# EAGLE design GPIB_2012 (EAGLE 5.11)

## Sheet 1 of 3
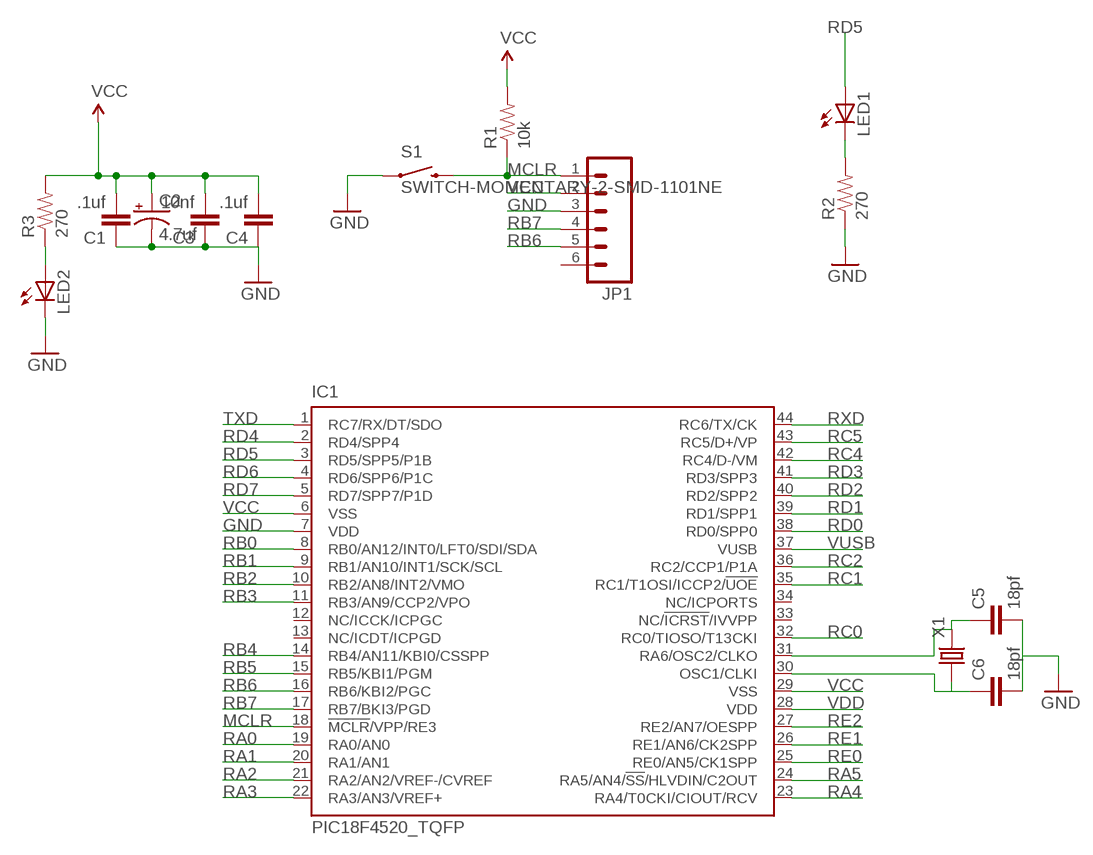
[diagram p0: schematic, sheet 1]

### Parts
C1  .1uf  CAP0805  [0805]
C2  4.7uf  CAP_POL6032  [EIA6032]
C3  10nf  CAP0805  [0805]
C4  .1uf  CAP0805  [0805]
C5  18pf  CAP0805  [0805]
C6  18pf  CAP0805  [0805]
IC1  PIC18F4520_TQFP  PIC18F4550_TQFP  [TQFP44]
JP1  M06SIP  [1X06]
LED1  LEDCHIPLED_1206  [CHIPLED_1206]
LED2  LEDCHIPLED_1206  [CHIPLED_1206]
R1  10k  RESISTOR0805-RES  [0805]
R2  270  RESISTOR0805-RES  [0805]
R3  270  RESISTOR0805-RES  [0805]
S1  SWITCH-MOMENTARY-2-SMD-1101NE  [TACTILE-SWITCH-1101NE]
X1  CRYSTAL-5032  [5032]

### Nets
GND: C1.1 C2.P$2(-) C3.1 C4.1 C5.2 C6.2 IC1.7(VDD) JP1.3 LED2.C R2.1 S1.P$1 ; also sheet 2,3
MCLR: IC1.18(!MCLR!/VPP/RE3) JP1.1 R1.1 S1.P$2
N$4: C5.1 IC1.31(RA6/OSC2/CLKO) X1.2
N$5: C6.1 IC1.30(OSC1/CLKI) X1.1
N$6: LED1.C R2.2
N$7: LED2.A R3.1
RA0: IC1.19(RA0/AN0) ; also sheet 3
RA1: IC1.20(RA1/AN1) ; also sheet 3
RA2: IC1.21(RA2/AN2/VREF-/CVREF) ; also sheet 3
RA3: IC1.22(RA3/AN3/VREF+) ; also sheet 3
RA4: IC1.23(RA4/T0CKI/CIOUT/RCV) ; also sheet 3
RA5: IC1.24(RA5/AN4/!SS!/HLVDIN/C2OUT) ; also sheet 3
RB0: IC1.8(RB0/AN12/INT0/LFT0/SDI/SDA) ; also sheet 3
RB1: IC1.9(RB1/AN10/INT1/SCK/SCL) ; also sheet 3
RB2: IC1.10(RB2/AN8/INT2/VMO) ; also sheet 3
RB3: IC1.11(RB3/AN9/CCP2/VPO) ; also sheet 3
RB4: IC1.14(RB4/AN11/KBI0/CSSPP) ; also sheet 3
RB5: IC1.15(RB5/KBI1/PGM) ; also sheet 3
RB6: IC1.16(RB6/KBI2/PGC) JP1.5 ; also sheet 3
RB7: IC1.17(RB7/BKI3/PGD) JP1.4 ; also sheet 3
RC0: IC1.32(RC0/TIOSO/T13CKI)
RC1: IC1.35(RC1/T1OSI/ICCP2/!UOE)
RC2: IC1.36(RC2/CCP1/P1A)
RC4: IC1.42(RC4/D-/VM)
RC5: IC1.43(RC5/D+/VP)
RD0: IC1.38(RD0/SPP0)
RD1: IC1.39(RD1/SPP1)
RD2: IC1.40(RD2/SPP2)
RD3: IC1.41(RD3/SPP3)
RD4: IC1.2(RD4/SPP4)
RD5: IC1.3(RD5/SPP5/P1B) LED1.A
RD6: IC1.4(RD6/SPP6/P1C)
RD7: IC1.5(RD7/SPP7/P1D)
RE0: IC1.25(RE0/AN5/CK1SPP) ; also sheet 3
RE1: IC1.26(RE1/AN6/CK2SPP) ; also sheet 3
RE2: IC1.27(RE2/AN7/OESPP)
RXD: IC1.44(RC6/TX/CK) ; also sheet 2
TXD: IC1.1(RC7/RX/DT/SDO) ; also sheet 2
VCC: C1.2 C2.P$1(+) C3.2 C4.2 IC1.6(VSS) IC1.29(VSS) JP1.2 R1.2 R3.2 ; also sheet 2,3
VDD: IC1.28(VDD)
VUSB: IC1.37(VUSB)
Unconnected: IC1.12(NC/ICCK/ICPGC) IC1.13(NC/ICDT/ICPGD) IC1.33(NC/!ICRST!/IVVPP) IC1.34(NC/ICPORTS) JP1.6

## Sheet 2 of 3
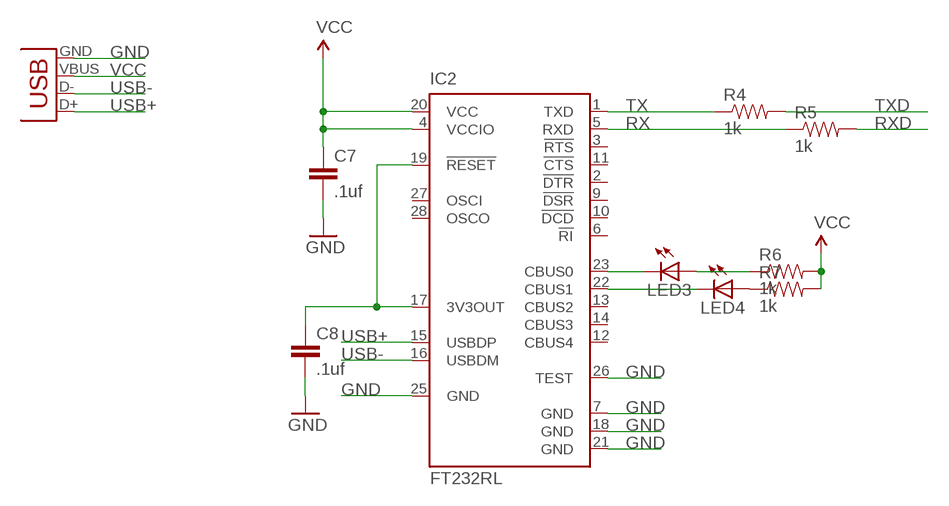
[diagram p1: schematic, sheet 2]

### Parts
C7  .1uf  CAP0805  [0805]
C8  .1uf  CAP0805  [0805]
IC2  FT232RL  [SSOP28]
LED3  LEDCHIPLED_1206  [CHIPLED_1206]
LED4  LEDCHIPLED_1206  [CHIPLED_1206]
R4  1k  RESISTOR0805-RES  [0805]
R5  1k  RESISTOR0805-RES  [0805]
R6  1k  RESISTOR0805-RES  [0805]
R7  1k  RESISTOR0805-RES  [0805]
X2  USBPTH  [USB-B-PTH]

### Nets
GND: C7.2 C8.2 IC2.7(GND) IC2.18(GND) IC2.21(GND) IC2.25(GND) IC2.26(TEST) X2.GND ; also sheet 1,3
LED_RX: IC2.23(CBUS0) LED3.C
LED_TX: IC2.22(CBUS1) LED4.C
N$1: LED3.A R6.1
N$2: LED4.A R7.1
N$3: C8.1 IC2.17(3V3OUT) IC2.19(!RESET)
RX: IC2.5(RXD) R5.1
RXD: R5.2 ; also sheet 1
TX: IC2.1(TXD) R4.1
TXD: R4.2 ; also sheet 1
USB+: IC2.15(USBDP) X2.D+
USB-: IC2.16(USBDM) X2.D-
VCC: C7.1 IC2.4(VCCIO) IC2.20(VCC) R6.2 R7.2 X2.VBUS ; also sheet 1,3
Unconnected: IC2.2(!DTR) IC2.3(!RTS) IC2.6(!RI) IC2.9(!DSR) IC2.10(!DCD) IC2.11(!CTS) IC2.12(CBUS4) IC2.13(CBUS2) IC2.14(CBUS3) IC2.27(OSCI) IC2.28(OSCO)

## Sheet 3 of 3
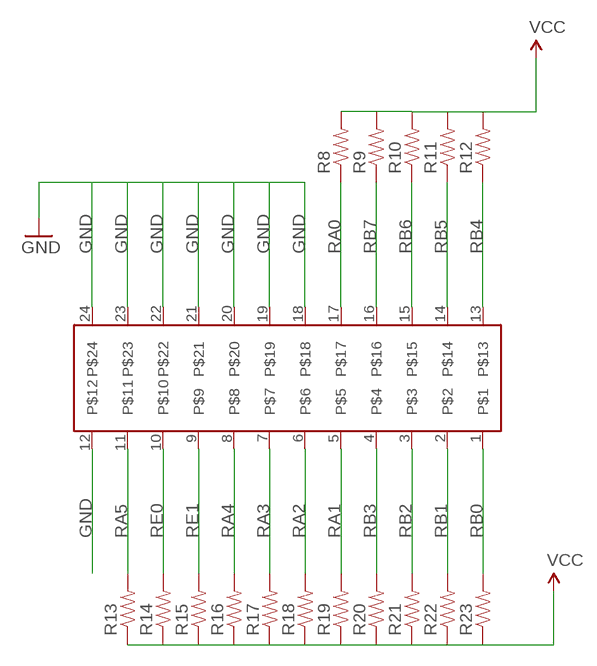
[diagram p2: schematic, sheet 3]

### Parts
R8  RESISTOR0805-RES  [0805]
R9  RESISTOR0805-RES  [0805]
R10  RESISTOR0805-RES  [0805]
R11  RESISTOR0805-RES  [0805]
R12  RESISTOR0805-RES  [0805]
R13  RESISTOR0805-RES  [0805]
R14  RESISTOR0805-RES  [0805]
R15  RESISTOR0805-RES  [0805]
R16  RESISTOR0805-RES  [0805]
R17  RESISTOR0805-RES  [0805]
R18  RESISTOR0805-RES  [0805]
R19  RESISTOR0805-RES  [0805]
R20  RESISTOR0805-RES  [0805]
R21  RESISTOR0805-RES  [0805]
R22  RESISTOR0805-RES  [0805]
R23  RESISTOR0805-RES  [0805]
U$1  112-024-213R001  24CONN24  [24CONN]

### Nets
GND: U$1.12 U$1.18 U$1.19 U$1.20 U$1.21 U$1.22 U$1.23 U$1.24 ; also sheet 1,2
RA0: R8.1 U$1.17 ; also sheet 1
RA1: R19.2 U$1.5 ; also sheet 1
RA2: R18.2 U$1.6 ; also sheet 1
RA3: R17.2 U$1.7 ; also sheet 1
RA4: R16.2 U$1.8 ; also sheet 1
RA5: R13.2 U$1.11 ; also sheet 1
RB0: R23.2 U$1.1 ; also sheet 1
RB1: R22.2 U$1.2 ; also sheet 1
RB2: R21.2 U$1.3 ; also sheet 1
RB3: R20.2 U$1.4 ; also sheet 1
RB4: R12.1 U$1.13 ; also sheet 1
RB5: R11.1 U$1.14 ; also sheet 1
RB6: R10.1 U$1.15 ; also sheet 1
RB7: R9.1 U$1.16 ; also sheet 1
RE0: R14.2 U$1.10 ; also sheet 1
RE1: R15.2 U$1.9 ; also sheet 1
VCC: R8.2 R9.2 R10.2 R11.2 R12.2 R13.1 R14.1 R15.1 R16.1 R17.1 R18.1 R19.1 R20.1 R21.1 R22.1 R23.1 ; also sheet 1,2

## Library data of the parts
C1 C3-C8 = SparkFun:CAP: Capacitor Standard 0603 ceramic capacitor, and 0.1" leaded capacitor.
C2 = SparkFun:CAP_POL: Capacitor Polarized These are standard SMD and PTH capacitors. Normally 10uF, 47uF, and 100uF in electrolytic and tantalum varieties. Always verify the external diameter of the through hole cap, it varies with capacity, voltage, and manufacturer. The EIA devices should be standard.
IC1 = microchip:PIC18F4*_TQFP: USB Microcontrollers with nanoWatt Technology High-Performance, Enhanced Flash, 28/40/44-Pin, Source: http://ww1.microchip.com/downloads/en/devicedoc/39632c.pdf; MF: MICROCHIP; MPN: PIC18F4550-I/PT; OC_FARNELL: 9321365; OC_NEWARK: 08J9633
IC2 = ftdichip:FT232R: Source: http://www.ftdichip.com/Documents/DataSheets/DS_FT232R_v104.pdf; MPN: FT232RL; OC_FARNELL: 1146032; OC_NEWARK: 91K9918
JP1 = SparkFun:M06: Header 6 Standard 6-pin 0.1" header. Use with straight break away headers (SKU : PRT-00116), right angle break away headers (PRT-00553), swiss pins (PRT-00743), machine pins (PRT-00117), and female headers (PRT-00115). Molex polarized connector foot print use with SKU : PRT-08094 with associated crimp pins and housings. NOTES ON THE VARIANTS LOCK and LOCK_LONGPADS... This footprint was designed to help hold the alignment of a through-hole component (i.e. 6-pin header) while soldering it into place. You may notice that each hole has been shifted either up or down by 0.005 of an inch from it's more standard position (which is a perfectly straight line). This slight alteration caused the pins (the squares in the middle) to touch the edges of the holes. Because they are alternating, it causes a "brace" to hold the component in place. 0.005 has proven to be the perfect amount of "off-center" position when using our standard breakaway headers. Although looks a little odd when you look at the bare footprint, once you have a header in there, the alteration is very hard to notice. Also, if you push a header all the way into place, it is covered up entirely on the bottom side. This idea of altering the position of holes to aid alignment will be further integrated into the Sparkfun Library for other footprints. It can help hold any component with 3 or more connection pins.
LED1-LED4 = led:LED: LED OSRAM: - CHIPLED LG R971, LG N971, LY N971, LG Q971, LY Q971, LO R971, LY R971 LH N974, LH R974 LS Q976, LO Q976, LY Q976 LO Q996 - Hyper CHIPLED LW Q18S LB Q993, LB Q99A, LB R99A - SideLED LS A670, LO A670, LY A670, LG A670, LP A670 LB A673, LV A673, LT A673, LW A673 LH A674 LY A675 LS A676, LA A676, LO A676, LY A676, LW A676 LS A679, LY A679, LG A679 - Hyper Micro SIDELED® LS Y876, LA Y876, LO Y876, LY Y876 LT Y87S - SmartLED LW L88C, LW L88S LB L89C, LB L89S, LG L890 LS L89K, LO L89K, LY L89K LS L896, LA L896, LO L896, LY L896 - TOPLED LS T670, LO T670, LY T670, LG T670, LP T670 LSG T670, LSP T670, LSY T670, LOP T670, LYG T670 LG T671, LOG T671, LSG T671 LB T673, LV T673, LT T673, LW T673 LH T674 LS T676, LA T676, LO T676, LY T676, LB T676, LH T676, LSB T676, LW T676 LB T67C, LV T67C, LT T67C, LS T67K, LO T67K, LY T67K, LW E67C LS E67B, LA E67B, LO E67B, LY E67B, LB E67C, LV E67C, LT E67C LW T67C LS T679, LY T679, LG T679 LS T770, LO T770, LY T770, LG T770, LP T770 LB T773, LV T773, LT T773, LW T773 LH T774 LS E675, LA E675, LY E675, LS T675 LS T776, LA T776, LO T776, LY T776, LB T776 LHGB T686 LT T68C, LB T68C - Hyper Mini TOPLED® LB M676 - Mini TOPLED Santana® LG M470 LS M47K, LO M47K, LY M47K Source: http://www.osram.convergy.de LUXEON: - LUMILED® LXK2-PW12-R00, LXK2-PW12-S00, LXK2-PW14-U00, LXK2-PW14-V00 LXK2-PM12-R00, LXK2-PM12-S00, LXK2-PM14-U00 LXK2-PE12-Q00, LXK2-PE12-R00, LXK2-PE12-S00, LXK2-PE14-T00, LXK2-PE14-U00 LXK2-PB12-K00, LXK2-PB12-L00, LXK2-PB12-M00, LXK2-PB14-N00, LXK2-PB14-P00, LXK2-PB14-Q00 LXK2-PR12-L00, LXK2-PR12-M00, LXK2-PR14-Q00, LXK2-PR14-R00 LXK2-PD12-Q00, LXK2-PD12-R00, LXK2-PD12-S00 LXK2-PH12-R00, LXK2-PH12-S00 LXK2-PL12-P00, LXK2-PL12-Q00, LXK2-PL12-R00 Source: www.luxeon.com KINGBRIGHT: KA-3528ASYC Source: www.kingbright.com
R1-R23 = SparkFun:RESISTOR: Resistor Basic schematic elements and footprints for 0603, 1206, and PTH resistors.
S1 = SparkFun:SWITCH-MOMENTARY-2
U$1 = GPIB_2012:24CONN
X1 = slice_noshift:CRYSTAL*: CRYSTAL
X2 = SparkFun:USB: USB Connectors USB-B-PTH is fully proven SKU : PRT-00139 USB-miniB is fully proven SKU : PRT-00587 USB-A-PCB is untested. USB-A-H is throughly reviewed, but untested. Spark Fun Electronics SKU : PRT-00437 USB-B-SMT is throughly reviewed, but untested. Needs silkscreen touching up. USB-A-S has not been used/tested USB-MB-H has not been used/tested

## Board
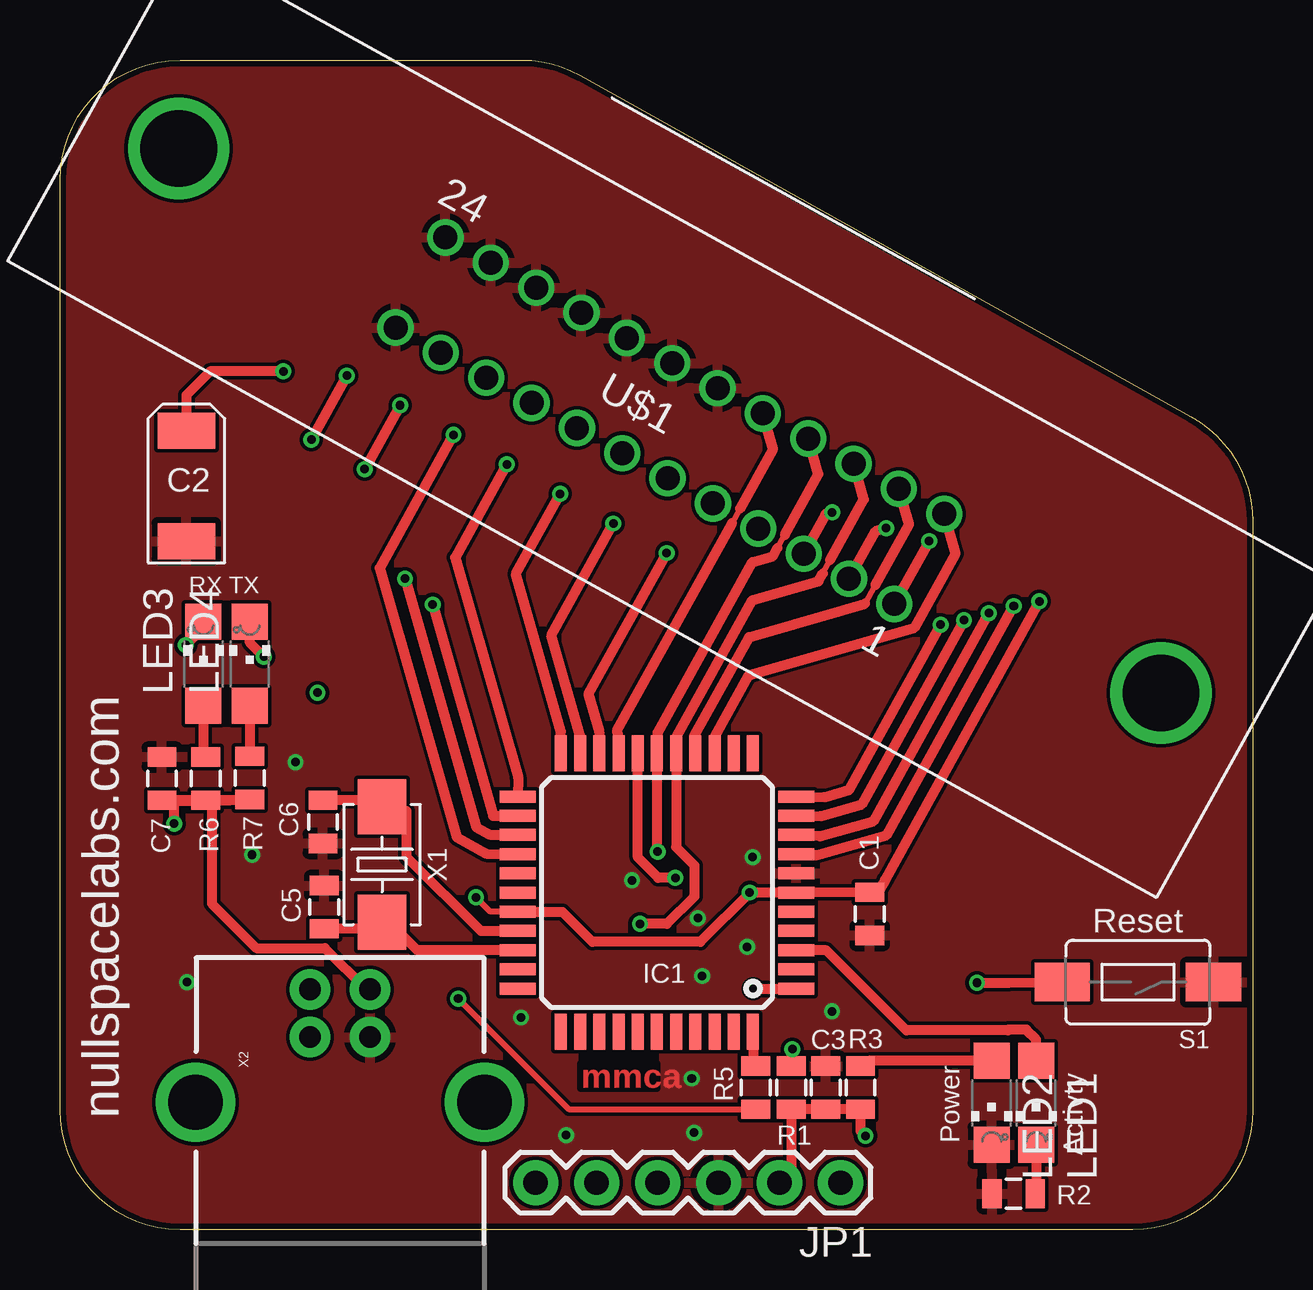
[diagram p3: board, top side]
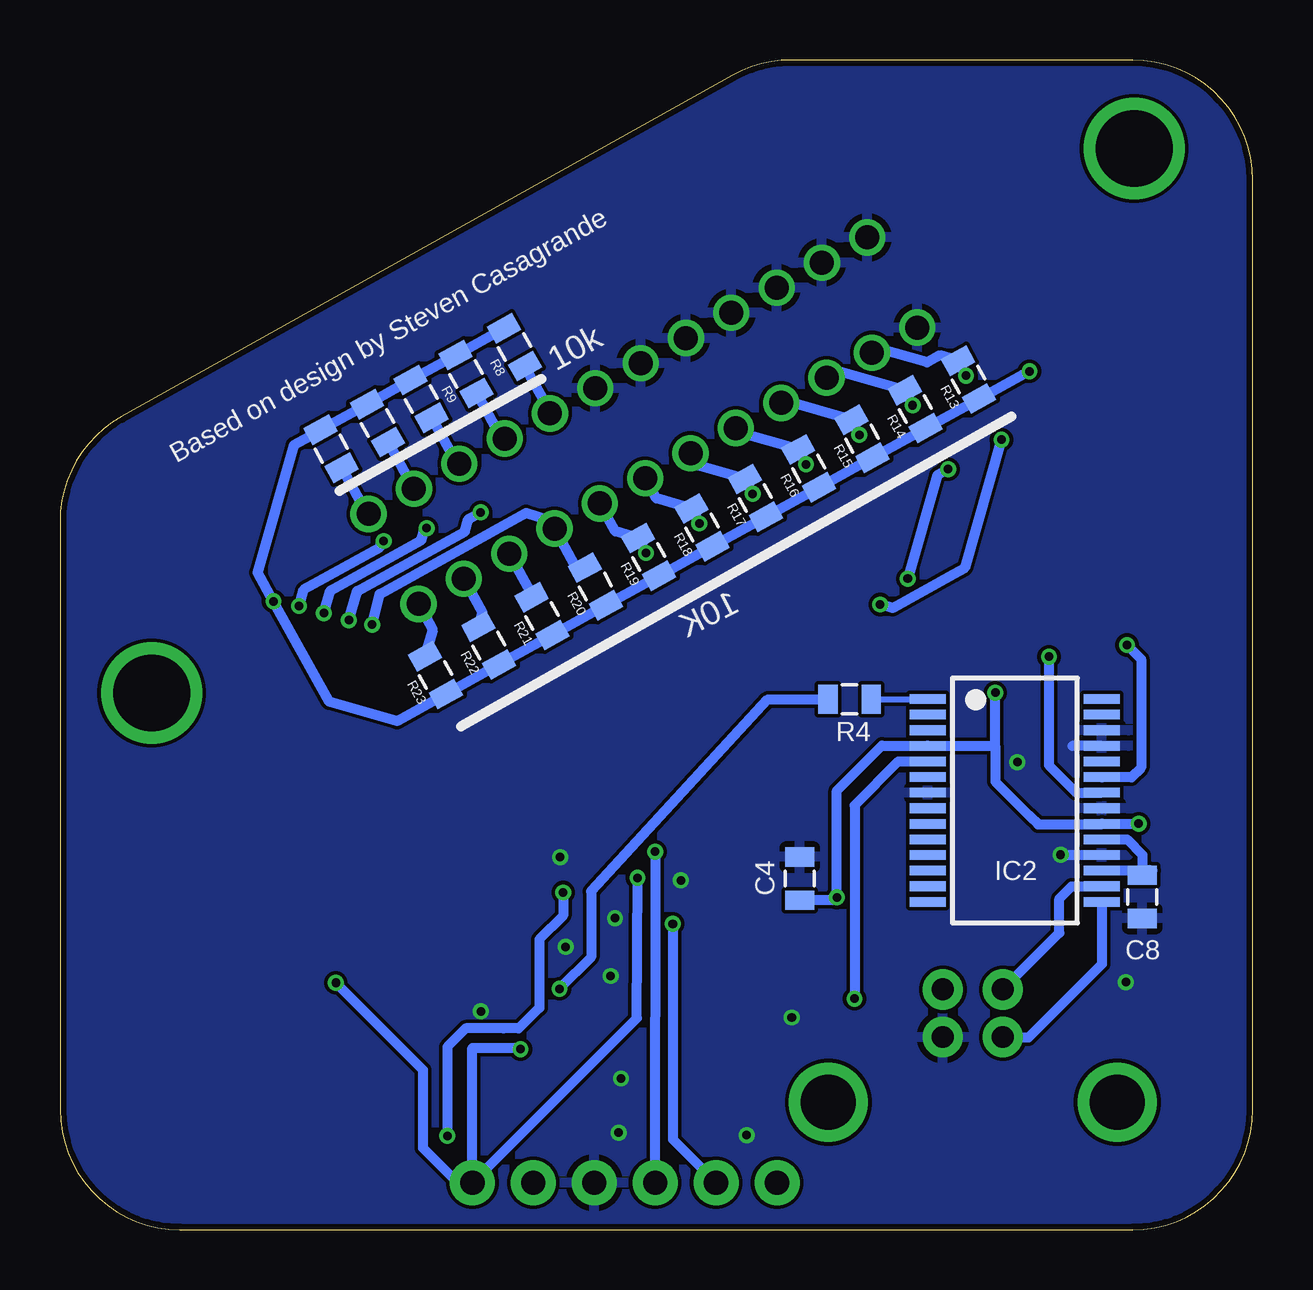
[diagram p4: board, bottom side, seen from below]

Size 49.7 x 48.74 mm. Coordinates in mm from the lower left corner, seen from the top.
Outline: 0,43.74 arc-90 5,48.74 19.23,48.74 arc-29 21.67,48.1 47.14,33.87 arc-61 49.7,29.5 49.7,5 arc-90 44.7,0 5,0 arc-90 0,5 0,43.74
Copper layers (1*16): Top 0.035mm / dielectric 1.5mm / Bottom 0.035mm
Design rules "ITead_rule": minimum track width 6mil, minimum drill 12mil, track to track 6mil, track to pad 6mil, pad to pad 6mil, via to via 6mil, smd to smd 0mil, copper to edge 10mil, drill to drill 10mil, minimum pad ring 10mil, minimum via ring 6mil, stop-mask expansion 2mil, vias tented up to drill 100mil, thermal gap 10mil

### Footprints (pad centres in the part's own frame; a part is rotated, then mirrored left to right if it is on the bottom)
0805 = smd 0.8 x 1.2: 1 -0.9,0; 2 0.9,0
EIA6032 = smd 1.5 x 2.4: P$1 -2.3,0; P$2 2.3,0
TQFP44 = smd 1.5 x 0.5: 1 -5.8,4; 2 -5.8,3.2; 3 -5.8,2.4; 4 -5.8,1.6; 5 -5.8,0.8; 6 -5.8,0; 7 -5.8,-0.8; 8 -5.8,-1.6; 9 -5.8,-2.4; 10 -5.8,-3.2; 11 -5.8,-4; 23 5.8,-4; 24 5.8,-3.2; 25 5.8,-2.4; 26 5.8,-1.6; 27 5.8,-0.8; 28 5.8,0; 29 5.8,0.8; 30 5.8,1.6; 31 5.8,2.4; 32 5.8,3.2; 33 5.8,4 | smd 0.5 x 1.5: 12 -4,-5.8; 13 -3.2,-5.8; 14 -2.4,-5.8; 15 -1.6,-5.8; 16 -0.8,-5.8; 17 0,-5.8; 18 0.8,-5.8; 19 1.6,-5.8; 20 2.4,-5.8; 21 3.2,-5.8; 22 4,-5.8; 34 4,5.8; 35 3.2,5.8; 36 2.4,5.8; 37 1.6,5.8; 38 0.8,5.8; 39 0,5.8; 40 -0.8,5.8; 41 -1.6,5.8; 42 -2.4,5.8; 43 -3.2,5.8; 44 -4,5.8
SSOP28 = smd 0.4 x 1.5: 1 -4.225,-3.625; 2 -3.575,-3.625; 3 -2.925,-3.625; 4 -2.275,-3.625; 5 -1.625,-3.625; 6 -0.975,-3.625; 7 -0.325,-3.625; 8 0.325,-3.625; 9 0.975,-3.625; 10 1.625,-3.625; 11 2.275,-3.625; 12 2.925,-3.625; 13 3.575,-3.625; 14 4.225,-3.625; 15 4.225,3.625; 16 3.575,3.625; 17 2.925,3.625; 18 2.275,3.625; 19 1.625,3.625; 20 0.975,3.625; 21 0.325,3.625; 22 -0.325,3.625; 23 -0.975,3.625; 24 -1.625,3.625; 25 -2.275,3.625; 26 -2.925,3.625; 27 -3.575,3.625; 28 -4.225,3.625
1X06 = drill 1.016 pad 1.88 round: 1 0,0; 2 2.54,0; 3 5.08,0; 4 7.62,0; 5 10.16,0; 6 12.7,0
CHIPLED_1206 = smd 1.5 x 1.5: A 0,-1.75; C 0,1.75
TACTILE-SWITCH-1101NE = smd 2.3 x 1.6: P$1 -3.15,0; P$2 3.15,0
24CONN = drill 1 round: 1 11.88,-2.145; 2 9.72,-2.145; 3 7.56,-2.145; 4 5.4,-2.145; 5 3.24,-2.145; 6 1.08,-2.145; 7 -1.08,-2.145; 8 -3.24,-2.145; 9 -5.4,-2.145; 10 -7.56,-2.145; 11 -9.72,-2.145; 12 -11.88,-2.145; 13 11.88,2.145; 14 9.72,2.145; 15 7.56,2.145; 16 5.4,2.145; 17 3.24,2.145; 18 1.08,2.145; 19 -1.08,2.145; 20 -3.24,2.145; 21 -5.4,2.145; 22 -7.56,2.145; 23 -9.72,2.145; 24 -11.88,2.145 | drill 3.2 round: P$1 23.4,0; P$2 -23.4,0
5032 = smd 2.286 x 2.032: 1 -2.413,0; 2 2.413,0
USB-B-PTH = drill 0.914 pad 1.676 round: D+ 0,1.25; D- 1.981,1.25; GND 0,-1.25; VBUS 1.981,-1.25 | drill 2.286 round: S1 -2.718,-6.02; S2 -2.718,6.02

### Placement (x,y rotation side)
C1  33.74,13.16 90 top
C2  5.27,30.99 270 top
C3  31.91,5.92 270 top
C4  18.88,14.63 270 bottom
C5  11.01,13.44 90 top
C6  10.96,16.99 270 top
C7  4.25,18.8 90 top
C8  4.61,13.87 270 bottom
IC1  24.87,14.05 180 top
IC2  9.91,17.88 270 bottom
JP1  32.52,1.96 180 top
LED1  40.67,5.28 180 top
LED2  38.82,5.28 180 top
LED3  5.98,23.57 0 top
LED4  7.91,23.57 0 top
R1  30.46,5.92 270 top
R2  39.73,1.5 0 top
R3  33.36,5.92 270 top
R4  16.8,22.1 180 bottom
R5  28.99,5.92 90 top
R6  6.08,18.8 270 top
R7  7.91,18.82 270 top
R8  30.76,36.77 119 bottom
R9  32.78,35.65 119 bottom
R10  34.65,34.62 119 bottom
R11  36.47,33.61 119 bottom
R12  38.4,32.54 119 bottom
R13  11.84,35.42 119 bottom
R14  14.07,34.19 119 bottom
R15  16.29,32.95 119 bottom
R16  18.51,31.72 119 bottom
R17  20.73,30.49 119 bottom
R18  22.95,29.26 119 bottom
R19  25.17,28.03 119 bottom
R20  27.39,26.8 119 bottom
R21  29.61,25.57 119 bottom
R22  31.84,24.34 119 bottom
R23  34.06,23.1 119 bottom
S1  44.91,10.31 180 top
U$1  25.41,33.7 331 top
X1  13.42,15.21 270 top
X2  11.67,8.03 90 top

### Tracks (layer width: path | path; a pad name or v marks a point on that pad's centre or on a via)
GND  (via drill 0.36)
  Top 0.406: JP1.3 27.44,2.24 | IC1.7 30.71,14.88
  Bottom 0.406: IC2.18 8.02,15.61 arc-89 8.03,15.6 | IC2.25 7.52,20.16
  other vias: 8.01,15.62 5.29,10.31 9.81,19.48 26.58,12.98 26.75,10.57 28.63,11.79 32.16,9.09 28.86,15.52 26.32,6.3 26.42,4.04 21.09,3.94 19.21,8.84 23.83,14.55
  pour Bottom: -1.36,49.2 -1.36,-0.58 50.58,-0.58 50.58,32.92 50.4,33.1 20.71,49.89 -0.65,49.89 arc90 -1.34,49.2
  pour Top: -1.34,49.4 -1.34,-0.94 50.78,-0.94 50.78,33.86 50.73,33.86 20.94,49.71 -1.03,49.71 arc90
LED_RX  (via drill 0.36)
  Top 0.406: v5.24,24.36 5.98,25.1 LED3.C
  Bottom 0.406: IC2.23 5.06,18.85 4.66,19.25 4.66,23.77 v5.24,24.36
LED_TX  (via drill 0.36)
  Top 0.406: v8.49,23.88 7.91,24.46 LED4.C
  Bottom 0.406: IC2.22 7.35,18.21 8.49,19.36 v8.49,23.88
MCLR  (via drill 0.36)
  Top 0.406: IC1.18 24.07,15.51 24.93,14.66 v25.64,14.66 25.61,14.66 | v30.51,7.52 30.46,7.47 R1.1 | S1.P$2 39.53,10.29 v38.21,10.29
  Bottom 0.406: v25.64,14.66 25.66,8.81 JP1.1 | JP1.1 32.52,7.52 32.52,7.57 30.56,7.57 v30.51,7.52 | v38.21,10.29 34.58,6.66 34.58,3.4 33.13,1.96 JP1.1
N$1
  Top 0.406: R6.1 5.98,19.8 LED3.A
N$2
  Top 0.406: LED4.A R7.1
N$3
  Bottom 0.406: IC2.17 4.19,14.96 arc-90 C8.1 4.61,15.62 5.24,16.26 IC2.19
N$4
  Top 0.406: C5.1 13.15,12.54 arc90 X1.2 arc-90 13.97,12.56 14.88,11.65 IC1.31
N$5
  Top 0.406: C6.1 13.99,17.89 arc-90 X1.1 14.43,17.45 14.44,15.55 17.53,12.45 IC1.30
N$6
  Top 0.406: R2.2 40.67,1.54 LED1.C
N$7
  Top 0.406: R3.1 33.42,6.76 33.7,7.03 LED2.A
RA0
  Top 0.254: 28.01,29.44 28.34,30.04
  Top 0.406: IC1.19 23.25,20.61 23.2,20.78 28.01,29.44 | 28.34,30.04 29.71,32.52 U$1.17
  Bottom 0.406: R8.1 29.27,34.08 U$1.17
RA1  (via drill 0.36)
  Top 0.406: IC1.20 22.46,20.75 22.02,22.31 v25.28,28.19
  Bottom 0.406: U$1.5 26.56,29.09 R19.2 25.27,28.22 v25.28,28.19
RA2  (via drill 0.36)
  Top 0.406: IC1.21 21.66,20.62 20.47,24.76 v23.06,29.43
  Bottom 0.406: U$1.6 24.85,30.47 R18.2 23.05,29.45 v23.06,29.43
RA3  (via drill 0.36)
  Top 0.406: IC1.22 20.87,20.76 18.99,27.32 v20.84,30.66
  Bottom 0.406: U$1.7 23.15,31.85 R17.2 20.83,30.68 v20.84,30.66
RA4  (via drill 0.36)
  Top 0.406: IC1.23 19.08,18.85 16.46,28 v18.62,31.89
  Bottom 0.406: U$1.8 21.44,33.23 R16.2 18.61,31.91 v18.62,31.89
RA5  (via drill 0.36)
  Top 0.406: IC1.24 18.05,17.25 v15.53,26.05 | v11.95,35.58 v10.47,32.92
  Bottom 0.406: U$1.11 15.56,36.71 13.57,36.14 13.05,36.43 R13.2 12.29,36.19 v11.95,35.58 | v15.53,26.05 15.01,25.9 12.45,27.32 12.01,27.56 v10.47,32.92
RB0  (via drill 0.36)
  Top 0.406: IC1.8 31.51,15.59 34.44,16.43 v39.74,25.99 | v36.22,28.7 v36.22,28.69 U$1.1
  Bottom 0.406: R23.2 34.17,25.01 U$1.1 | v39.74,25.99 39.54,26.68 36.36,28.44 36.31,28.65 v36.22,28.7
RB1  (via drill 0.36)
  Top 0.406: IC1.9 31.66,16.38 33.9,17.03 v38.7,25.69 | v34.42,29.23 33.97,29.1 U$1.2
  Bottom 0.406: R22.2 32.1,25.72 U$1.2 | 34.53,29.16 v34.42,29.23 34.51,29.18 34.64,28.73 38.44,26.62 v38.7,25.69
RB2  (via drill 0.36)
  Top 0.406: 30.72,17.2 IC1.10 31.69,17.23 33.42,17.73 v37.67,25.39 | v32.17,29.89 31.9,29.81 U$1.3
  Bottom 0.406: R21.2 30.03,26.44 U$1.3 | 32.29,29.83 v32.17,29.89 32.68,29.61 32.83,29.09 37.32,26.6 v37.67,25.39
RB3  (via drill 0.36)
  Top 0.406: IC1.11 31.84,18.02 32.88,18.32 v36.69,25.21
  Bottom 0.406: R20.2 28.26,27.71 U$1.4 | U$1.4 29.33,29.64 | v36.69,25.21 36.38,26.48 30.27,29.87 29.29,29.57 U$1.4
RB4
  Top 0.406: IC1.14 27.29,20.55 28.7,23.1 35.61,25.08 37.32,28.17 U$1.13
  Bottom 0.406: R12.1 36.91,29.84 U$1.13
RB5
  Top 0.254: 33.55,26.08 33.98,26.86
  Top 0.406: IC1.15 26.43,20.58 28.71,24.69 33.55,26.08 | 33.98,26.86 35.38,29.38 U$1.14
  Bottom 0.406: R11.1 U$1.14
RB6  (via drill 0.36)
  Top 0.254: 31.78,27.35 32.09,27.9
  Top 0.406: 31.78,27.35 31.6,27.02 28.83,26.22 25.69,20.56 IC1.16 25.67,15.93 26.43,15.18 26.43,13.88 26.4,13.86 25.29,12.74 v24.17,12.74 | 32.09,27.9 33.49,30.43 U$1.15
  Bottom 0.406: R10.1 33.17,31.95 U$1.15 | v24.17,12.74 24.17,3.76 JP1.5
RB7  (via drill 0.36)
  Top 0.254: 29.89,28.4 30.2,28.95
  Top 0.406: v24.9,15.75 24.87,15.77 IC1.17 24.9,20.71 28.85,27.81 29.71,28.06 29.89,28.4 | 30.2,28.95 31.6,31.48 U$1.16
  Bottom 0.406: v24.9,15.75 24.93,1.98 JP1.4 | R9.1 31.31,33 U$1.16
RD5
  Top 0.406: IC1.3 30.69,11.66 30.71,11.63 31.94,11.63 35.26,8.31 39.5,8.31 39.53,8.33 40.27,8.33 40.67,7.93 LED1.A
RE0  (via drill 0.36)
  Top 0.406: IC1.25 17.9,16.46 17.35,16.76 v14.38,27.12 | v14.17,34.35 v12.69,31.69
  Bottom 0.406: U$1.10 17.27,35.77 R14.2 14.51,34.95 v14.17,34.35 | v12.69,31.69 13.14,31.44 v14.38,27.12
RE1  (via drill 0.36)
  Top 0.406: IC1.26 17.76,15.67 16.53,16.34 13.32,27.57 v16.39,33.12
  Bottom 0.406: U$1.9 19.49,34.54 R15.2 16.73,33.72 v16.39,33.12
RX  (via drill 0.36)
  Top 0.254: R5.1 21.2,5.02 v16.59,9.63
  Bottom 0.254: IC2.5
  Bottom 0.406: v16.59,9.63 16.59,17.68 14.77,19.51 IC2.5
RXD
  Top 0.406: R5.2 28.9,6.91 IC1.44
TX
  Bottom 0.254: IC2.1 R4.1
TXD  (via drill 0.36)
  Top 0.254: 30.66,10.03 IC1.1
  Top 0.406: v28.89,10.03 30.66,10.03
  Bottom 0.406: R4.2 20.2,22.1 27.57,14.1 27.57,11.35 v28.89,10.03
USB+
  Bottom 0.406: IC2.15 6.29,11.07 9.36,8 10.39,8 X2.D+
USB-
  Bottom 0.406: IC2.16 7.55,14.31 8.06,13.79 8.06,12.36 X2.D-
VCC  (via drill 0.36)
  Top 0.254: IC1.29 17.93,13.25 v17.33,13.84
  Top 0.406: X2.VBUS 12.76,10.01 11.03,11.74 8.19,11.74 6.33,13.59 6.33,17.87 | 6.33,17.87 R7.2 R6.2 C7.1 | IC1.29 19.09,13.23 20.94,13.23 22.18,11.99 26.68,11.99 v28.74,14.05 IC1.6 C1.2 34.15,14.18 34.38,14.58 v40.8,26.18 | JP1.2 30.46,2.44 R1.2 C3.2 R3.2 33.36,4.12 v33.56,3.91 | 6.33,17.87 4.76,17.87 v4.76,16.92 | v9.3,35.76 6.26,35.76 5.27,34.77 C2.P$1
  Bottom 0.254: IC2.4
  Bottom 0.406: C4.2 17.44,13.73 v17.33,13.84 17.33,18.29 15.45,20.17 IC2.4 10.79,20.16 arc90 10.73,20.09 | v28.74,14.05 28.74,13.08 29.73,12.09 29.73,9.25 30.59,8.38 31.22,8.38 32.8,8.38 33.56,7.62 v33.56,3.91 | v4.76,16.92 v4.77,16.91 IC2.20 6.31,16.89 8.95,16.89 9.29,17.23 10.73,18.67 10.73,20.09 | 10.73,20.09 v10.73,22.38 | v9.3,35.76 9.34,35.77 R13.1 R14.1 | R14.1 | R14.1 R15.1 R16.1 R17.1 R18.1 R19.1 R20.1 R21.1 R22.1 R23.1 35.65,21.19 38.49,22 v40.8,26.18 41.47,27.38 39.95,32.7 38.84,33.31 R12.2 R11.2 R10.2 R9.2 R8.2

### Text on the board
Top: mmca
tPlace: C2 | RX TX | Reset | nullspacelabs.com | Power | Activty
bPlace: 10k | Based on design by Steven Casagrande | 10K